# Altium schematic sheet USBModule.SchDoc
size A; SheetNumber: 8; SheetTotal: 9; SPICEModelCacheSHGCPFIO: <root> / <DocumentId>SHGCPFIO</DocumentId> / <CacheFrame Number="0"> / <Model Name="emk105bj105_v-f" Kind="CKT"> / <Text>* EMK105BJ105_V-F     SPICE MODEL  ( General Type ) / *-------------------------------------------------------------------------------------------------------- / * Model Generated by TAIYO YUDEN Corporation (http://www.ty-top.com) / * Version 1.0 / * TAIYO YUDEN Control No. 170508_130520 / * Copyright(c) 2012 TAIYO YUDEN CO.,LTD. All Rights Reserved. / *-------------------------------------------------------------------------------------------------------- / * / * Products Name : Multilayer Ceramic Capacitors / * / * Characteristics : / *     Capacitance : 1 uF , Rated Voltage : 16V , TCC : X5R / *     Case Size : 1.0 x 0.5 / 0.039 x 0.02 [mm/inch] , Thickness : 0.5 / 0.02 [mm/inch] / *     (Conditions: Temperature = 25 degC , DC Bias Current/Voltage = 0A / 0V) / * / * Frequency Range : 40Hz - 3GHz / * / * External Node Assignments : / * / *  1  o---| |---o  2 / * / *-------------------------------------------------------------------------------------------------------- / .SubCkt EMK105BJ105_V-F 1 2 / **************************** / C0 1 110 0.68309u / Cm 1 101 0.26053u / C1 101 102 0.94076u / Rc1 101 102 1.9029k / C2 102 103 0.66707u / Rc2 102 103 120.36 / C3 103 110 0.57203u / Rc3 103 110 2.1097 / C2m 1 301 0.1871u / C21 301 302 3.2494u / Rc21 301 302 1.1117k / C22 302 303 2.1014u / Rc22 302 303 1.484k / C23 303 304 2.1172u / Rc23 303 304 1.3876k / C24 304 305 0.75729u / Rc24 304 305 332.59 / C25 305 306 0.94401u / Rc25 305 306 249.09 / C26 306 307 0.34674u / Rc26 306 307 28.352 / C27 307 308 0.37158u / Rc27 307 308 19.989 / C28 308 309 0.17933u / Rc28 308 309 31.748 / C29 309 110 0.016445u / Rc29 309 110 1.0592 / Rp0 1 110 100Meg / L0 110 120 0.2216n / Lm 120 130 0.1509n / L1 120 121 0.12659n / RL1 121 130 0.85161 / L2 120 122 0.15996n / RL2 122 130 0.42469 / L3 120 123 7.9543n / RL3 123 130 0.54643m / CR 120 124 0.24334u / LR 124 125 0.090738n / RR 125 130 68.076m / CL 130 140 2.7354p / LL 130 140 0.10762n / RL 130 140 50.614 / Rs 140 2 7.5416m / **************************** / .ends EMK105BJ105_V-F</Text> / </Model> / </CacheFrame> / </root>
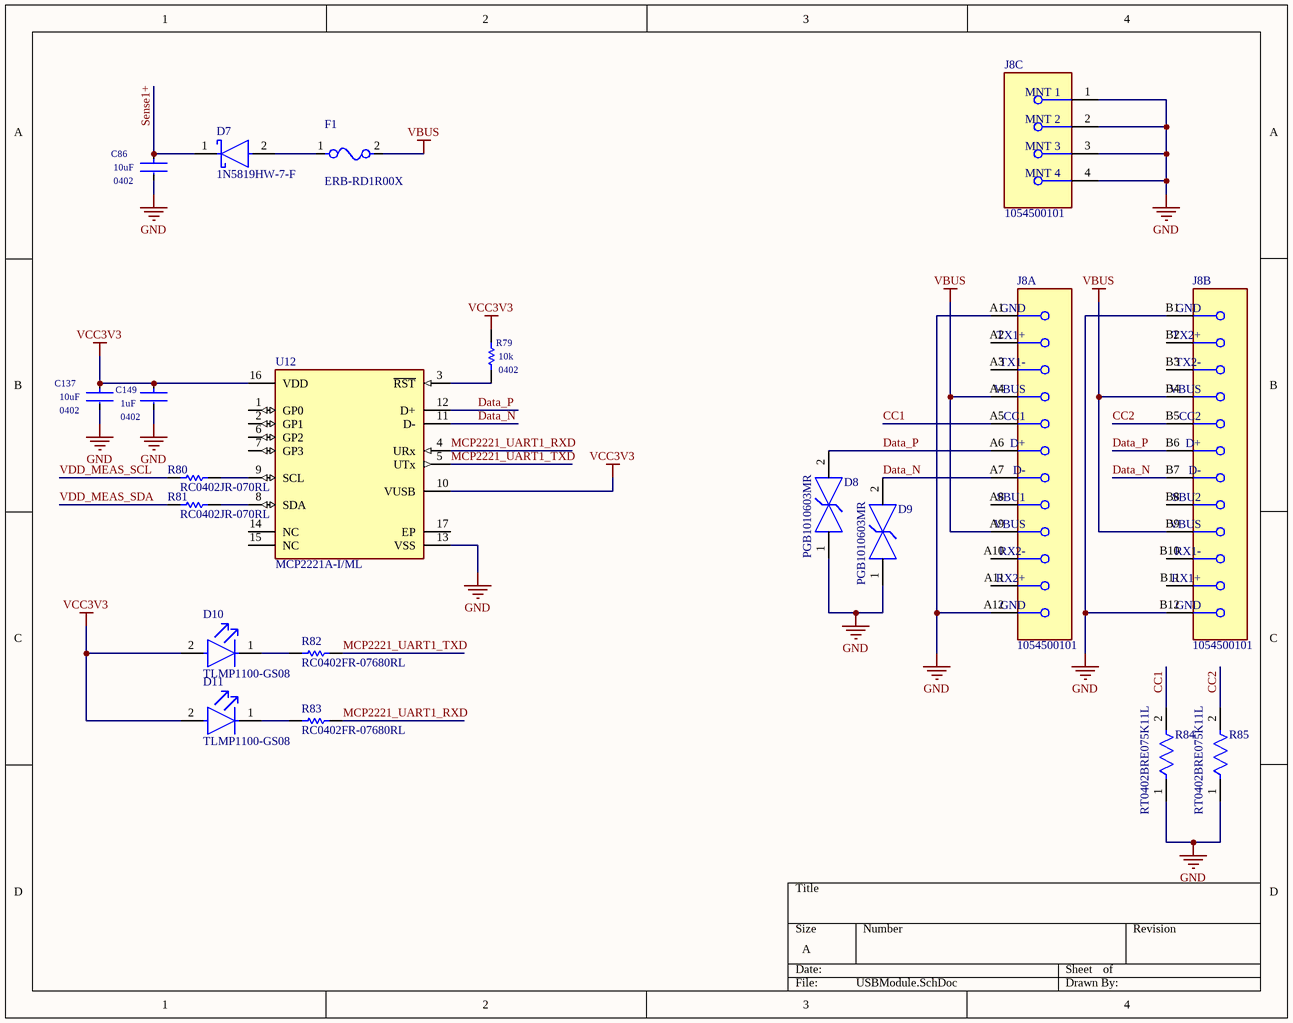
[diagram p0: USBModule.SchDoc]

## Parts
C86  Case/Package: 0402  Capacitance: 10uF  [FP-GRM155-0_2-IPC_B]  (hidden comment: GRM155R60J106ME44D)
C137  Case/Package: 0402  Capacitance: 10uF  [FP-GRM155-0_2-IPC_B]  (hidden comment: GRM155R60J106ME44D)
C149  Case/Package: 0402  Capacitance: 1uF  [FP-0402-L_1_0_0_05-W_0_5-IPC_A]  (hidden comment: EMK105BJ105KV-F)
D7  1N5819HW-7-F  [FP-SOD123-IPC_A]
D8  PGB1010603MR  [FP-PGB1-0603-CA-MFG]
D9  PGB1010603MR  [FP-PGB1-0603-CA-MFG]
D10  TLMP1100-GS08  [FP-6_541-5056_01-4-MFG]
D11  TLMP1100-GS08  [FP-6_541-5056_01-4-MFG]
F1  ERB-RD1R00X  [FP-ERBRD-MFG]
J8  1054500101  [FP-1054500101-MFG]  (parts A,B,C of 3)
R79  Parameter 3: 10k  Parameter 4: 0402  [RESC1005X40X25NL05T10]  (hidden comment: RC0402FR-0710KL)
R80  RC0402JR-070RL  [RESC1005X40X25NL05T10]
R81  RC0402JR-070RL  [RESC1005X40X25NL05T10]
R82  RC0402FR-07680RL  [RESC1005X40X25LL05T10]
R83  RC0402FR-07680RL  [RESC1005X40X25LL05T10]
R84  RT0402BRE075K11L  [FP-RT0402-MFG]
R85  RT0402BRE075K11L  [FP-RT0402-MFG]
U12  MCP2221A-I/ML  [FP-C04-127-MFG]

## Nets
GND: C86.2 C137.2 C149.2 D8.1 D9.1 J8.1(MNT_1) J8.2(MNT_2) J8.3(MNT_3) J8.4(MNT_4) J8.A1(GND) J8.A12(GND) J8.B1(GND) J8.B12(GND) R84.1 R85.1 U12.13(VSS)
VBUS: F1.2 J8.A4(VBUS) J8.A9(VBUS) J8.B4(VBUS) J8.B9(VBUS)
VCC3V3: C137.1 C149.1 D10.2(A) D11.2(A) R79.2 U12.10(VUSB) U12.16(VDD)
CC1: J8.A5(CC1) R84.2
CC2: J8.B5(CC2) R85.2
Data_N: D9.2 J8.A7(D-) J8.B7(D-) U12.11(D-)
Data_P: D8.2 J8.A6(D+) J8.B6(D+) U12.12(D+)
MCP2221_UART1_RXD: R83.2 U12.4(URx)
MCP2221_UART1_TXD: R82.2 U12.5(UTx)
Sense1+: C86.1 D7.1(C)
VDD_MEAS_SCL: R80.1
VDD_MEAS_SDA: R81.1
NetD7_2: D7.2(A) F1.1
NetD10_1: D10.1(C) R82.1
NetD11_1: D11.1(C) R83.1
NetR79_1: R79.1 U12.3(~{RST})
NetR80_2: R80.2 U12.9(SCL)
NetR81_2: R81.2 U12.8(SDA)

Not connected (* = marked no-connect by the designer): J8 A2(TX1+) A3(TX1-) A8(SBU1) A10(RX2-) A11(RX2+) B2(TX2+) B3(TX2-) B8(SBU2) B10(RX1-) B11(RX1+); U12 1(GP0) 2(GP1) 6(GP2) 7(GP3) 14(NC) 15(NC) 17(EP)

## Library data of the parts
C86 C137 = CMP-2000-05265-2: CAP CER 10UF 6.3V X5R 0402; Tolerance: 20%; Voltage Rating: 6.3V; Voltage Rating (DC): 6.3V; Voltage: 6.3V; Case Code (Metric): 1005; REACH SVHC: No SVHC; Min Operating Temperature: -55°C; Height: 0.5mm; Dielectric: X5R; Depth: 0.5mm; Thickness: 0.022inch; Packaging: Tape and Reel; Length: 1mm; Mount: Surface Mount; Package Quantity: 10000; Lead Free: Lead Free; Termination: SMD/SMT; Max Operating Temperature: 85°C; Case Code (Imperial): 0402; Series: GRM; Width: 0.5mm; RoHS Compliant: Yes
C149 = CMP-14477-000104-2: None; Tolerance: 10%; Voltage Rating: 16V; Dielectric: X5R; Packaging: Tape and Reel; Depth: 0.5mm; Mount: Surface Mount; Thickness: 0.022inch; Package Quantity: 1; Min Operating Temperature: -55°C; Series: M; Voltage Rating (DC): 16V; Termination: SMD/SMT; Number of Pins: 2; Case Code (Imperial): 0402; Length: 1mm; Halogen Free: Halogen Free; Case Code (Metric): 1005; Width: 0.02inch; RoHS Compliant: Yes; Radiation Hardening: No; Max Operating Temperature: 85°C; Height: 0.5mm; Construction: Flat
D7 = CMP-0303-00003-3: DIODE SCHOTTKY 40V 1A SOD123; Forward Voltage: 450mV; Capacitance: 110pF; Max Forward Surge Current (Ifsm): 25A; Peak Reverse Current: 50uA; Polarity: Standard; Element Configuration: Single; Max Power Dissipation: 450mW; Min Operating Temperature: -65°C; Package Quantity: 3000; Contact Plating: Tin; Weight: 0.000353oz; Max Repetitive Reverse Voltage (Vrrm): 40V; Max Reverse Voltage (DC): 40V; Height: 1.25mm; Average Rectified Current: 1A; Width: 1.7mm; Case/Package: SOD-123-2; Lead Free: Lead Free; Max Operating Temperature: 125°C; Current Rating: 1A; Termination: SMD/SMT; Forward Current: 1A; Radiation Hardening: No; Number of Pins: 2; Length: 2.85mm; Voltage Rating (DC): 40V; REACH SVHC: No SVHC; Peak Non-Repetitive Surge Current: 25A; Packaging: Tape and Reel; Output Current: 1A
D8 D9 = CMP-2000-05190-2: TVS DIODE 24V 150V 0603; Number of Channels: 1; Power Line Protection: No; Breakdown Voltage: 500V; Direction: Bidirectional; Leakage Current: 1nA; Element Configuration: Single; Capacitance: 0.06pF; Operating Supply Voltage: 24V; Lead Free: Lead Free; Number of Elements: 1; Width: 787um; Reverse Standoff Voltage: 24V; Height: 0.36mm; Number of Bidirectional Channels: 1; Voltage Rating (DC): 24V; Case Code (Metric): 1608; Radiation Hardening: No; Depth: 0.84mm; Max Operating Temperature: 125°C; Length: 1.66mm; Clamping Voltage: 150V; Number of Pins: 2; Case/Package: 0603; Min Operating Temperature: -65°C; Mount: Surface Mount; Case Code (Imperial): 0603; Working Voltage: 24V; Polarity: Bidirectional; Termination: SMD/SMT; Packaging: Tape and Reel; Composition: Zener
D10 D11 = CMP-02520-000009-1: LED GREEN 0603 SMD; Manufacturer: Vishay; Max Junction Temp: +120°C; Automotive Grade: Grade 3; Reverse Voltage: 6V; Led Orientation: Top View; Forward Voltage: 2.1V; Luminous Intensity: 15mcd; Forward Current: 20mA; Colour: Pure green; Peak Emmision Wavelength: 562nm; Wavelength: 561nm; Viewing Angle: 160°; Power Dissipation: 90mW; Digikey Description: LED GREEN 0603 SMD; Package: 6.541-5056.01-4; Ambient Temperature Range High: +100°C; Height: 0.65mm; Device Class L1: Optoelectronics; Device Class L2: LEDs; Mouser Description: Standard LEDs - SMD Pure Green; Temperature Range High: +120°C; RoHS: TRUE; Ambient Temperature Range Low: -40°C; Temperature: to +120°C; Manufacturer Part Number: TLMP1100-GS08; ComponentLink2URL: http://www.vishay.com/docs/83173/tlmb1100.pdf; Lead Free: Yes; Octopart: https://octopart.com/tlmp1100-gs08-vishay-55433993; Automotive: Yes; Device Class L3: unset; ComponentLink2Description: Datasheet; Category: Diode
F1 = CMP-00287-21220529-1: ERB-RD1R00X Fuse Chip Fast Acting 1A 32V SMD Solder Pad 0402 1 X 0.5 X 0.39mm T/R UL/cUL; Body Material: Alumina; Approvals: UL; Resistance: 125mΩ; Case Code (Metric): 1005; Current: 1A; Voltage Rating: 32V; Current Rating: 1A; Depth: 500µm; Lifecycle Status: Production; Max Operating Temperature: 125°C; Case Code (Imperial): 0402; Radiation Hardening: No; Mount: Surface Mount; Height: 490µm; Voltage Rating (DC): 32V; Case/Package: 0402; Min Operating Temperature: -40°C; Fuse Current: 1A; Max Voltage Rating (DC): 32V; Width: 500µm; RoHS: Compliant; Length: 1mm; REACH SVHC: No SVHC; Packaging: Cut Tape; Number of Pins: 2
J8 = CMP-04767-000004-1: CONN RCP USB3.1 TYPEC 24P SMD RA; Manufacturer: Molex; Number Of Contacts: 24; Voltage Rating: 30V; Shielding: true; Is Female: yes; Current Rating: 0.25/1.25/5A; Pitch: 0.5mm; Conn Orientation: Right Angle; Package: 0; Height: 3.44mm; Footprint Url: https://www.molex.com/pdm_docs/sd/1054500101_sd.pdf; Device Class L1: Connectors; Category: Conn; Device Class L2: USB Connectors; Digikey Description: CONN RCP USB3.1 TYPEC 24P SMD RA; Contact Material: Gold,Nickel; Mouser Description: USB Shielded I/O Receptacle; Type C; Right Angle; Surface Mount; Gold over Nickel; ComponentLink2Description: Datasheet; Lead Free: Yes; Automotive: No; Temperature Range High: +85°C; RoHS: TRUE; Octopart: https://octopart.com/105450-0101-molex-68082325; ComponentLink2URL: https://www.molex.com/webdocs/datasheets/pdf/en-us/1054500101_IO_CONNECTORS.pdf; Temperature: -30°C to +85°C; Usb Standard: USB 3.1; Temperature Range Low: -30°C; Device Class L3: unset; Manufacturer Part Number: 1054500101
R79 = CMP-2002-07353-1: Manufacturer: Yageo / Phycomp; Part Number: RC0402FR-0710KL
R80 R81 = CMP-1011-00001-2: Manufacturer: Yageo / Phycomp; Part Number: RC0402JR-070RL
R82 R83 = CMP-2002-07010-1: Manufacturer: Yageo / Phycomp; Part Number: RC0402FR-07680RL
R84 R85 = CMP-03412-002989-1: RES 5.11K OHM 1/16W .1% SMD 0402; Manufacturer: Yageo; Value: 5.11KΩ; Voltage Rating: 50V; Power Rating: 0.063W; Tolerance: 0.001; Temperature Coefficient: 50 ppm/°C; Lead Free: Yes; ComponentLink2URL: http://www.yageo.com/documents/recent/PYu-RT_1-to-0.01_RoHS_L_9.pdf; Category: Res; ComponentLink2Description: Datasheet; Temperature Range Low: -55°C; Device Class L3: Chip SMD Resistors; Automotive: No; Temperature Range High: +155°C; Octopart: https://octopart.com/rt0402bre075k11l-yageo-1442753; Device Class L2: Resistors; Height: 0.35mm; Composition: Thin Film; Package: RT0402; Manufacturer Part Number: RT0402BRE075K11L; RoHS: TRUE; Temperature: -55°C to +155°C; Resistance: 5.11KΩ; Footprint Url: http://www.yageo.com/exep/pages/download/literatures/PYu-R_Mount_10.pdf; Device Class L1: Passive Components; Series: RT; Digikey Description: RES 5.11K OHM 1/16W .1% SMD 0402; Ipc Land Pattern Name: RESC10050X30
U12 = CMP-06284-000031-1: IC USB TO I2C/UART 16QFN; Operating Supply Current: 13mA; Interface: I2C; Packaging: Rail/Tube; Case/Package: VQFN; Max Operating Temperature: 85°C; RoHS Compliant: Yes; Min Operating Temperature: -40°C